# Altium schematic sheet 4_Solder-Pen.SchDoc
size A4; SheetNumber: 5; SheetTotal: 5; SPICEModelCacheUOHFEEZY: <root> / <DocumentId>UOHFEEZY</DocumentId> / </root>
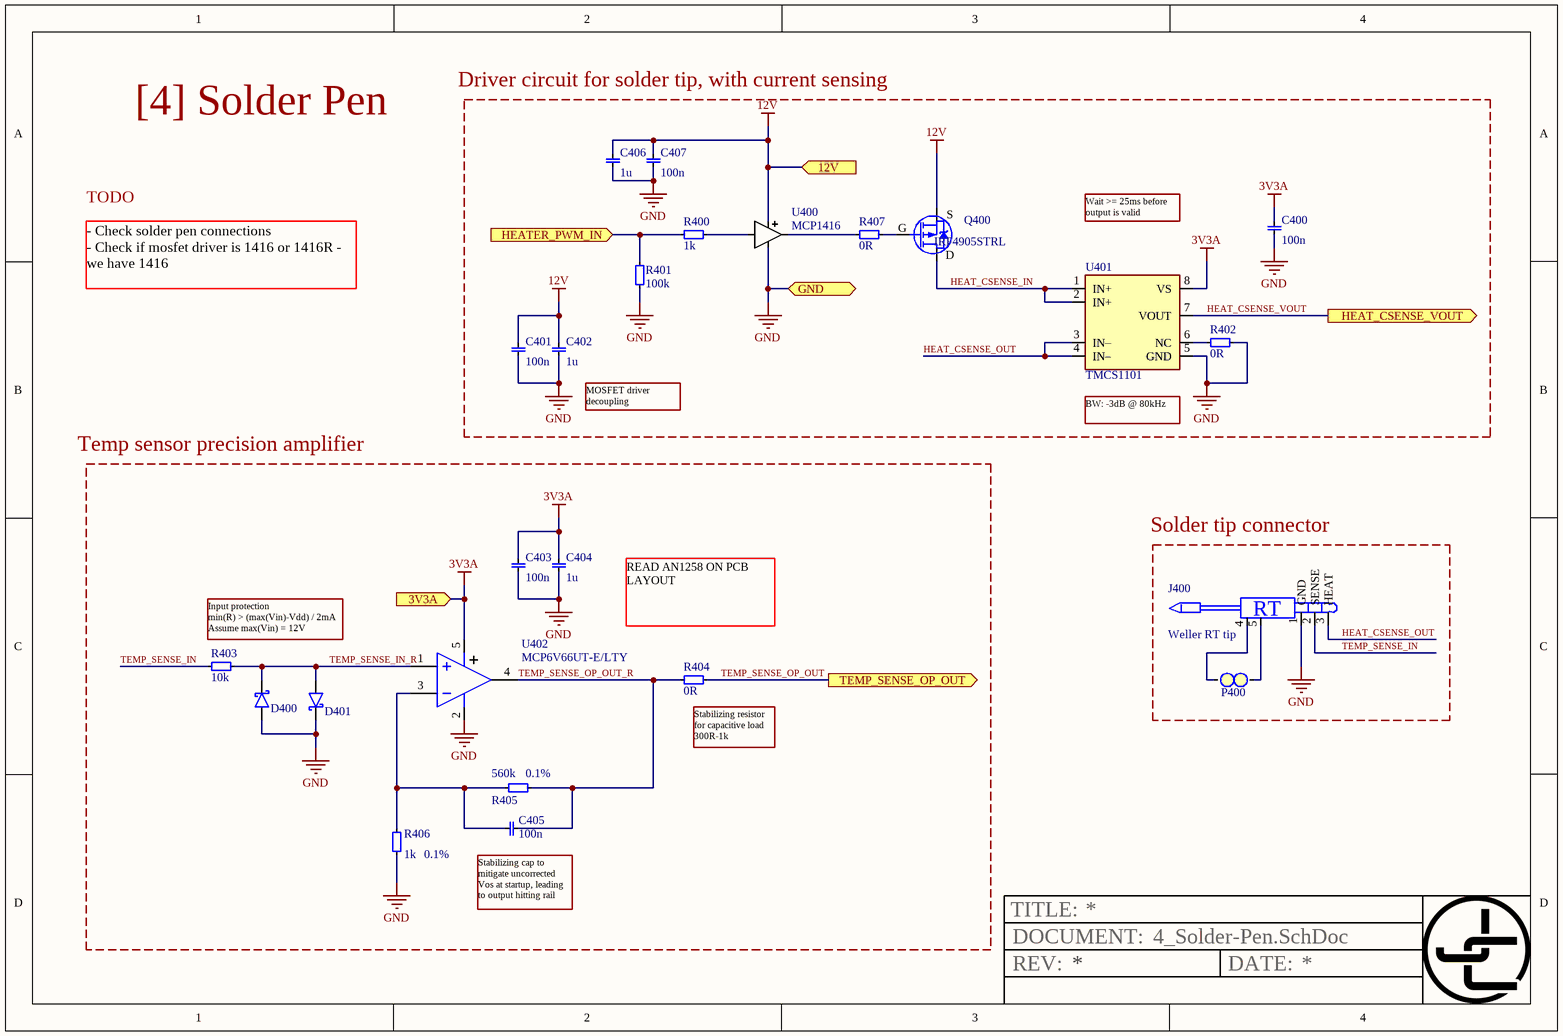
[diagram p0: 4_Solder-Pen.SchDoc]

## Parts
C400  value 100n  [0805, cap]  (hidden comment: 0805, capacitor)
C401  value 100n  [0805, cap]  (hidden comment: 0805, capacitor)
C402  value 1u  [0805, cap]  (hidden comment: 0805, capacitor)
C403  value 100n  [0805, cap]  (hidden comment: 0805, capacitor)
C404  value 1u  [0805, cap]  (hidden comment: 0805, capacitor)
C405  value 100n  [0805, cap]  (hidden comment: 0805, capacitor)
C406  value 1u  [0805, cap]  (hidden comment: 0805, capacitor)
C407  value 100n  [0805, cap]  (hidden comment: 0805, capacitor)
D400  B340A  [DO-214AC]  (value not drawn)
D401  B340A  [DO-214AC]  (value not drawn)
J400  Weller RT tip  [5 POLE BLOCK CONNECTOR]
P400  1x2 Pin Heade Straight  [padtwo_L]  (value not drawn)
Q400  IRF4905  [d2pak]  (value not drawn)
R400  value 1k  [0603]  (hidden comment: 0603, resistor)
R401  value 100k  [0603]  (hidden comment: 0603, resistor)
R402  value 0R  [0603]  (hidden comment: 0603, resistor)
R403  value 10k  [0603]  (hidden comment: 0603, resistor)
R404  value 0R  [0603]  (hidden comment: 0603, resistor)
R405  value 560k  Tolerance: 0.1%  [0603]  (hidden comment: 0603, resistor)
R406  value 1k  Tolerance: 0.1%  [0603]  (hidden comment: 0603, resistor)
R407  value 0R  [0603]  (hidden comment: 0603, resistor)
U400  MCP1416  [SOT23-5]
U401  TMCS1101  [SOIC8]
U402  MCP6V66UT-E/LTY  [SC70P210X110-5N]

## Blocks framed on the sheet
IRF4905STRL: C400-C402 C406 C407 Q400 R400-R402 R407 U400 U401

## Ports
3V3A (in), 12V (in), GND (bidir), HEAT_CSENSE_VOUT (out), HEATER_PWM_IN (in), TEMP_SENSE_OP_OUT (out)

## Nets
3V3A: C400.1 C403.1 C404.1 U401.8(VS) U402.5(V+) ; port 3V3A
12V: C401.1 C402.1 C406.1 C407.1 Q400.3(S) U400.5 ; port 12V
GND: C400.0 C401.0 C402.0 C403.0 C404.0 C406.0 C407.0 D400.2(A) D401.1(K) J400.1(GND) R401.1 R402.1 R406.1 U400.2 U401.5(GND) U402.2(V-) ; port GND
HEAT_CSENSE_IN: Q400.2(D) U401.1(IN+) U401.2(IN+)
HEAT_CSENSE_OUT: J400.3(HEAT) U401.3(IN–) U401.4(IN–)
HEAT_CSENSE_VOUT: U401.7(VOUT) ; port HEAT_CSENSE_VOUT
HEATER_PWM_IN: R400.1 R401.0 ; port HEATER_PWM_IN
TEMP_SENSE_IN: J400.2(SENSE) R403.0
TEMP_SENSE_IN_R: D400.1(K) D401.2(A) R403.1 U402.1(IN+)
TEMP_SENSE_OP_OUT: R404.1 ; port TEMP_SENSE_OP_OUT
TEMP_SENSE_OP_OUT_R: C405.0 R404.0 R405.1 U402.4(OUT)
NetC405_1: C405.1 R405.0 R406.0 U402.3(IN-)
NetJ400_4: J400.4 P400.1
NetJ400_5: J400.5 P400.2
NetQ400_1: Q400.1(G) R407.0
NetR400_0: R400.0 U400.3
NetR402_0: R402.0 U401.6(NC)
NetR407_1: R407.1 U400.4

## Notes on the sheet
- [4] Solder Pen
- Driver circuit for solder tip, with current sensing
- TODO
- Wait >= 25ms before
  output is valid
- - Check solder pen connections
  - Check if mosfet driver is 1416 or 1416R - we have 1416
- Temp sensor precision amplifier
- (near C402) MOSFET driver decoupling
- BW: -3dB @ 80kHz
- Solder tip connector
- (near R403) Input protection
  min(R) > (max(Vin)-Vdd) / 2mA
  Assume max(Vin) = 12V
- READ AN1258 ON PCB LAYOUT
- (near R404) Stabilizing resistor
  for capacitive load
  300R-1k
- (near C405) Stabilizing cap to
  mitigate uncorrected
  Vos at startup, leading
  to output hitting rail
- TITLE:
- REV:
- DOCUMENT:
- DATE:
- (in symbol Weller RT tip) RT

## Library data of the parts
D400 D401 = B340A-E3/61T: SchottkydiodE, 40 V, 3 A; Value: Schottky Diode; Farnell: 2335183
P400 = 1x2 Pin Heade Straight: 2.54 mm, TH; Value: 1x2 Pin Header
Q400 = IRF4905: P-Channel HEXFET® Power MOSFET
U400 = MCP1416: High-speed Power MOSFET driver
U401 = TMCS1101: Hall-Effect Current Sensor
U402 = MCP6V66UT-E/LTY: Linear High Precision Op Amps-Chopper Stabilized, 1000kHz, 1.8Vto5.5V, SC70-5, RoHS; Manufacturer: Microchip; Supplier 1: Avnet; Manufacturer Part Number: MCP6V66UT-E/LTY; RoHS: No; Category: Amplifiers - Op Amps, Buffer, Instrumentation; Stock 1: 50; Pricing 1: 3000=0,93150 (USD); Supplier Part Number 1: MCP6V66UT-E/LTY